# Altium schematic sheet HMI.SchDoc
size A4; SheetNumber: 13; SheetTotal: 18
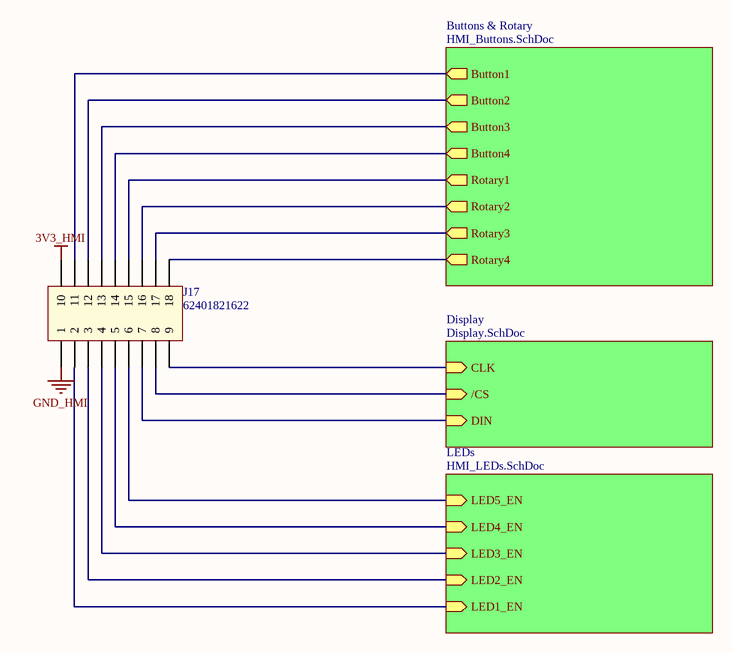
[diagram p0: HMI.SchDoc]

## Parts
J17  62401821622  [62401821622]

## Sub-sheets
Buttons & Rotary = HMI_Buttons.SchDoc: Button1 (out), Button2 (out), Button3 (out), Button4 (out), Rotary1 (out), Rotary2 (out), Rotary3 (out), Rotary4 (out)
Display = Display.SchDoc: DIN (in), /CS (in), CLK (in)
LEDs = HMI_LEDs.SchDoc: LED1_EN (in), LED2_EN (in), LED3_EN (in), LED4_EN (in), LED5_EN (in)

## Nets
3V3_HMI: J17.10
GND_HMI: J17.1
NetJ17_2: J17.2 ; sheet LEDs/LED1_EN
NetJ17_3: J17.3 ; sheet LEDs/LED2_EN
NetJ17_4: J17.4 ; sheet LEDs/LED3_EN
NetJ17_5: J17.5 ; sheet LEDs/LED4_EN
NetJ17_6: J17.6 ; sheet LEDs/LED5_EN
NetJ17_7: J17.7 ; sheet Display/DIN
NetJ17_8: J17.8 ; sheet Display//CS
NetJ17_9: J17.9 ; sheet Display/CLK
NetJ17_11: J17.11 ; sheet Buttons & Rotary/Button1
NetJ17_12: J17.12 ; sheet Buttons & Rotary/Button2
NetJ17_13: J17.13 ; sheet Buttons & Rotary/Button3
NetJ17_14: J17.14 ; sheet Buttons & Rotary/Button4
NetJ17_15: J17.15 ; sheet Buttons & Rotary/Rotary1
NetJ17_16: J17.16 ; sheet Buttons & Rotary/Rotary2
NetJ17_17: J17.17 ; sheet Buttons & Rotary/Rotary3
NetJ17_18: J17.18 ; sheet Buttons & Rotary/Rotary4

## Library data of the parts
J17 = 62401821622: WR-WTB 2.00mm Male Dual Row Vertical Shrouded Header with positive locking, 18p; Pin Number: 18; ID: WE 2x9 Vertical THT; ComponentLink1Description: Manufacturer; ComponentLink1URL: http://www.we-online.de; ComponentLink2Description: Datasheet; ComponentLink2URL: http://katalog.we-online.de/em/datasheet/6240xx21622.pdf; Part Number: 62401821622; Published Date: June 2017; Publisher: Wurth Elektronik; Pitch: 2.00 mm; Order Number: 62401821622; Package: 62401821622; NI part number: -; NI PEN/DEB: -; Type: Header WE 18-way; Distributor: Würth; Link: http://katalog.we-online.de/em/datasheet/6240xx21622.pdf; Price (HUF): 0; Note: Positive Lock